# EAGLE schematic Schematic_v26 (EAGLE 9.7.0)
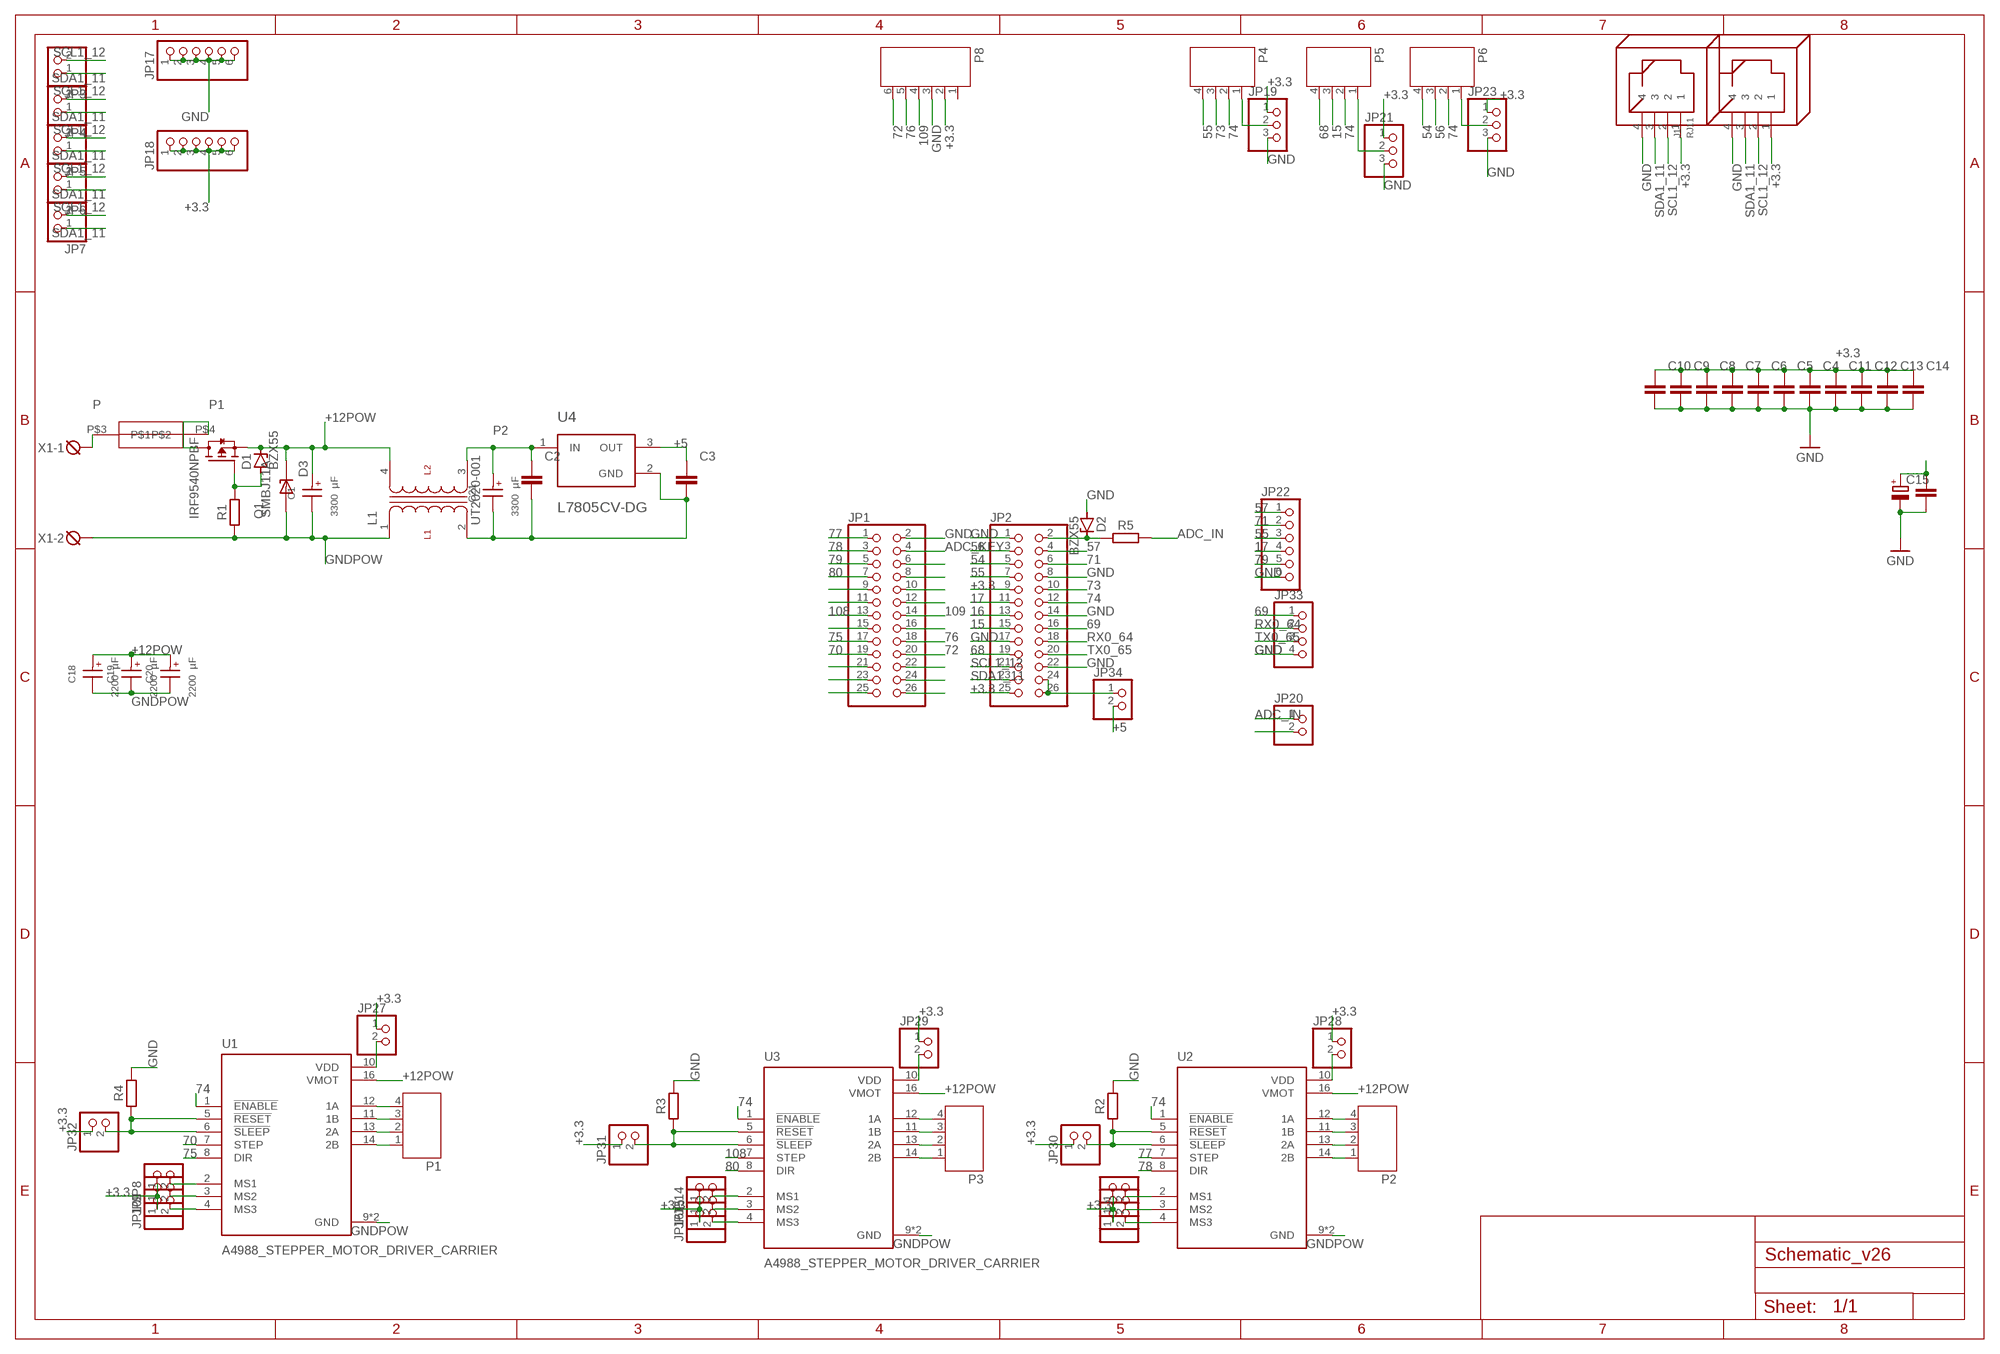
[diagram p0: schematic, sheet 1]

## Parts
C1  3300 µF  WCAP-AT1H_13X20_860240278009  [WCAP-AT1H_13X20(DXL)]
C2  C_CHIP-1206(3216-METRIC)  [CAPC3216X135]
C3  C_CHIP-0603(1608-METRIC)  [CAPC1608X85]
C4  C_CHIP-0603(1608-METRIC)  [CAPC1608X85]
C5  C_CHIP-0603(1608-METRIC)  [CAPC1608X85]
C6  C_CHIP-0603(1608-METRIC)  [CAPC1608X85]
C7  C_CHIP-0603(1608-METRIC)  [CAPC1608X85]
C8  C_CHIP-0603(1608-METRIC)  [CAPC1608X85]
C9  C_CHIP-0603(1608-METRIC)  [CAPC1608X85]
C10  C_CHIP-0603(1608-METRIC)  [CAPC1608X85]
C11  C_CHIP-1206(3216-METRIC)  [CAPC3216X135]
C12  C_CHIP-1206(3216-METRIC)  [CAPC3216X135]
C13  C_CHIP-1206(3216-METRIC)  [CAPC3216X135]
C14  C_CHIP-1206(3216-METRIC)  [CAPC3216X135]
C15  C-POL_RADIAL-11MM-DIA  [CAPPRD508W65D1000H1100B]
C18  2200 µF  WCAP-AT1H_13X20_860240278009  [WCAP-AT1H_13X20(DXL)]
C19  2200 µF  WCAP-AT1H_13X20_860240278009  [WCAP-AT1H_13X20(DXL)]
C20  2200 µF  WCAP-AT1H_13X20_860240278009  [WCAP-AT1H_13X20(DXL)]
C21  3300 µF  WCAP-AT1H_13X20_860240278009  [WCAP-AT1H_13X20(DXL)]
C22  C_CHIP-1206(3216-METRIC)  [CAPC3216X135]
D1  BZX55  [DO35Z10]
D2  BZX55  [DO35Z10]
D3  SMBJ11A  [DIOM4336X265N]
J1  RJ11  [RJ11]
J3  RJ11  [RJ11]
JP1  PINHD-2X13  [2X13]
JP2  PINHD-2X13  [2X13]
JP3  PINHD-1X2  [1X02]
JP4  PINHD-1X2  [1X02]
JP5  PINHD-1X2  [1X02]
JP6  PINHD-1X2  [1X02]
JP7  PINHD-1X2  [1X02]
JP8  PINHD-1X2  [1X02]
JP9  PINHD-1X2  [1X02]
JP10  PINHD-1X2  [1X02]
JP11  PINHD-1X2  [1X02]
JP12  PINHD-1X2  [1X02]
JP13  PINHD-1X2  [1X02]
JP14  PINHD-1X2  [1X02]
JP15  PINHD-1X2  [1X02]
JP16  PINHD-1X2  [1X02]
JP17  PINHD-1X6  [1X06]
JP18  PINHD-1X6  [1X06]
JP19  PINHD-1X3  [1X03]
JP20  PINHD-1X2  [1X02]
JP21  PINHD-1X3  [1X03]
JP22  PINHD-1X6  [1X06]
JP23  PINHD-1X3  [1X03]
JP27  PINHD-1X2  [1X02]
JP28  PINHD-1X2  [1X02]
JP29  PINHD-1X2  [1X02]
JP30  PINHD-1X2  [1X02]
JP31  PINHD-1X2  [1X02]
JP32  PINHD-1X2  [1X02]
JP33  PINHD-1X4  [1X04]
JP34  PINHD-1X2  [1X02]
L1  UT2020-001  [IND_UT2020-001]
P1  JST-PH4  [JST-PH4]
P2  JST-PH4  [JST-PH4]
P3  JST-PH4  [JST-PH4]
P4  JST-PH4  [JST-PH4]
P5  JST-PH4  [JST-PH4]
P6  JST-PH4  [JST-PH4]
P8  JST-PH6  [JST-PH6]
Q1  IRF9540NPBF  [TO254P1052X465X1989-3]
R1  R_AXIAL-7.2MM-PITCH  [RESAD724W46L381D178B]
R2  R_CHIP-1206(3216-METRIC)  [RESC3216X70]
R3  R_CHIP-1206(3216-METRIC)  [RESC3216X70]
R4  R_CHIP-1206(3216-METRIC)  [RESC3216X70]
R5  R_CHIP-1206(3216-METRIC)  [RESC3216X70]
U1  A4988_STEPPER_MOTOR_DRIVER_CARRIER  [MODULE_A4988_STEPPER_MOTOR_DRIVER_CARRIER]
U2  A4988_STEPPER_MOTOR_DRIVER_CARRIER  [MODULE_A4988_STEPPER_MOTOR_DRIVER_CARRIER]
U3  A4988_STEPPER_MOTOR_DRIVER_CARRIER  [MODULE_A4988_STEPPER_MOTOR_DRIVER_CARRIER]
U4  L7805CV-DG  [TO255P1040X460X2890-3]
U$1  POJ  [POJ]
X1  DG3XX-02-3.5  [DG350-3.5-02P]

## Nets
15: JP2.15 P5.3
16: JP2.13
17: JP2.11 JP22.4
54: JP2.5 P6.4
55: JP2.7 JP22.3 P4.4
56: JP2.3 P6.3
57: JP2.4 JP22.1
68: JP2.19 P5.4
69: JP2.16 JP33.1
70: JP1.19 U1.7(STEP)
71: JP2.6 JP22.2
72: JP1.20 P8.6
73: JP2.10 P4.3
74: JP2.12 P4.2 P5.2 P6.2 U1.1(!ENABLE) U2.1(!ENABLE) U3.1(!ENABLE)
75: JP1.17 U1.8(DIR)
76: JP1.18 P8.5
77: JP1.1 U2.7(STEP)
78: JP1.3 U2.8(DIR)
79: JP1.5 JP22.5
80: JP1.7 U3.8(DIR)
108: JP1.13 U3.7(STEP)
109: JP1.14 P8.4
+3.3 [lidlpower]: C4.1 C5.1 C6.1 C7.1 C8.1 C9.1 C10.1 C11.1 C12.1 C13.1 C14.1 J1.1 J3.1 JP2.9 JP2.25 JP8.1 JP9.1 JP10.1 JP11.1 JP12.1 JP13.1 JP14.1 JP15.1 JP16.1 JP18.1 JP18.2 JP18.3 JP18.4 JP18.5 JP18.6 JP19.1 JP21.1 JP23.1 JP27.1 JP28.1 JP29.1 JP30.1 JP31.1 JP32.1 P8.2
+5 [lidlpower]: C3.1 C15.1(+) C22.1 JP34.2 U4.3(OUT)
+12POW [power]: C1.1(+) C18.1(+) C19.1(+) C20.1(+) D1.C D3.C L1.4 Q1.3(S) U1.16(VMOT) U2.16(VMOT) U3.16(VMOT)
ADC_IN: JP20.1 R5.2
ADC_KEY: JP1.4
GND [lidlpower]: C2.2 C3.2 C4.2 C5.2 C6.2 C7.2 C8.2 C9.2 C10.2 C11.2 C12.2 C13.2 C14.2 C15.2(-) C21.2(-) C22.2 D2.A J1.4 J3.4 JP1.2 JP2.1 JP2.8 JP2.14 JP2.17 JP2.22 JP17.1 JP17.2 JP17.3 JP17.4 JP17.5 JP17.6 JP19.3 JP20.2 JP21.3 JP22.6 JP23.3 JP33.4 L1.2 P8.3 R2.2 R3.2 R4.2 U4.2(GND)
GNDPOW [power]: C1.2(-) C18.2(-) C19.2(-) C20.2(-) D3.A L1.1 R1.1 U1.9(GND) U1.15(GND) U2.9(GND) U2.15(GND) U3.9(GND) U3.15(GND) X1.2
N$1: JP8.2 U1.2(MS1)
N$2: P1.4 U1.12(1A)
N$3: P1.3 U1.11(1B)
N$4: P1.2 U1.13(2A)
N$5: JP1.9
N$6: JP1.11
N$7: P1.1 U1.14(2B)
N$8: JP1.15
N$9: P2.4 U2.12(1A)
N$10: P2.3 U2.11(1B)
N$11: JP1.21
N$12: JP1.23
N$13: JP1.25
N$14: P2.2 U2.13(2A)
N$15: P2.1 U2.14(2B)
N$16: JP1.6
N$17: JP1.8
N$18: JP1.10
N$19: JP1.12
N$20: P3.4 U3.12(1A)
N$21: JP1.16
N$22: P3.3 U3.11(1B)
N$23: P3.2 U3.13(2A)
N$24: JP1.22
N$25: JP1.24
N$26: JP1.26
N$27: P3.1 U3.14(2B)
N$28: JP9.2 U1.3(MS2)
N$29: JP10.2 U1.4(MS3)
N$30: JP11.2 U2.2(MS1)
N$31: JP12.2 U2.3(MS2)
N$32: JP13.2 U2.4(MS3)
N$33: JP14.2 U3.2(MS1)
N$34: JP15.2 U3.3(MS2)
N$35: JP16.2 U3.4(MS3)
N$36: JP2.24 JP2.26 JP34.1
N$37: JP30.2 R2.1 U2.5(!RESET) U2.6(!SLEEP)
N$38: JP31.2 R3.1 U3.5(!RESET) U3.6(!SLEEP)
N$40: D1.A Q1.1(G) R1.2
N$42: JP27.2 U1.10(VDD)
N$44: D2.C JP2.2 R5.1
N$46: JP29.2 U3.10(VDD)
N$47: JP19.2 P4.1
N$48: JP28.2 U2.10(VDD)
N$51: JP21.2 P5.1
N$55: JP23.2 P6.1
N$67: JP32.2 R4.1 U1.5(!RESET) U1.6(!SLEEP)
P [power]: U$1.P$3 X1.1
P1 [power]: Q1.2(D) U$1.P$4
P2 [lidlpower]: C2.1 C21.1(+) L1.3 U4.1(IN)
RX0_64: JP2.18 JP33.2
SCL1_12: J1.2 J3.2 JP2.21 JP3.2 JP4.2 JP5.2 JP6.2 JP7.2
SDA1_11: J1.3 J3.3 JP2.23 JP3.1 JP4.1 JP5.1 JP6.1 JP7.1
TX0_65: JP2.20 JP33.3
Unconnected: P8.1

## Library data of the parts
C1 C21 = Wurth_Capacitors_WCAP-AT1H:WCAP-AT1H_13X20: WCAP-AT1H Aluminium Electrolytic Capacitors Long Life +105 °C Characteristics Long life product series Mounting style: THT Radial Capacitance range: 6.8 µF ‒ 3300 µF Capacitance tolerance: ±20 % Voltage range (UR): 10 ‒ 450 V(DC) Operating temperature: -40 °C up to +105 °C for UR ≤100 V(DC) -25 °C up to +105 °C for UR > 100 V(DC) Endurance: 5000 ‒ 10000 h @ +105 °C Dimensions (DxL) in mm: 5.0 x 11.0 up to 18.0 x 35.5 Recommended soldering: Wave soldering Applications Long life applications (industry, medical) Filtering Smoothing Energy storage Coupling e.g. Switched-mode power supply, AC/DC converter, adapter, charger, digital camera <https://www.we-online.com/catalog/media/o14727v209%20Family_WCAP-AT1H.jpg> Details see: https://www.we-online.com/catalog/en/WCAP-AT1H/ Updated by yingchun,Shan;2020-02-28 2020(C) Würth Elektronik; DATASHEET-URL: https://www.we-online.com/catalog/datasheet/860240278009.pdf; DF: 19%; DIAMETER: 13mm; I-LEAK: 220uA; I-RIPPLE: 1540mA; L: 20mm; OPERATING-TEMPERATURE: -40 °C up to +105 °C; PART-NUMBER: 860240278009; PITCH: 5mm; TECHNICAL-REFERENCE: ATDI200222M010DSPACK000; VALUE: 2200 µF; VR: 10V(DC)
C2-C14 C22 = Capacitor:C: Capacitor - Generic; CATEGORY: Capacitor
C15 = Capacitor:C-POL: Capacitor Polarised - Generic; CATEGORY: Capacitor
C18-C20 = Wurth_Capacitors_WCAP-AT1H:WCAP-AT1H_13X20: WCAP-AT1H Aluminium Electrolytic Capacitors Long Life +105 °C Characteristics Long life product series Mounting style: THT Radial Capacitance range: 6.8 µF ‒ 3300 µF Capacitance tolerance: ±20 % Voltage range (UR): 10 ‒ 450 V(DC) Operating temperature: -40 °C up to +105 °C for UR ≤100 V(DC) -25 °C up to +105 °C for UR > 100 V(DC) Endurance: 5000 ‒ 10000 h @ +105 °C Dimensions (DxL) in mm: 5.0 x 11.0 up to 18.0 x 35.5 Recommended soldering: Wave soldering Applications Long life applications (industry, medical) Filtering Smoothing Energy storage Coupling e.g. Switched-mode power supply, AC/DC converter, adapter, charger, digital camera <https://www.we-online.com/catalog/media/o14727v209%20Family_WCAP-AT1H.jpg> Details see: https://www.we-online.com/catalog/en/WCAP-AT1H/ Updated by yingchun,Shan;2020-02-28 2020(C) Würth Elektronik; DATASHEET-URL: https://www.we-online.com/catalog/datasheet/860240278009.pdf; DF: 19%; DIAMETER: 13mm; I-LEAK: 220uA; I-RIPPLE: 1540mA; L: 20mm; OPERATING-TEMPERATURE: -40 °C up to +105 °C; PART-NUMBER: 860240278009; PITCH: 5mm; TECHNICAL-REFERENCE: ATDI200222M010DSPACK000; VR: 10V(DC)
D1 D2 = diode:BZX55: Z DIODE
D3 = SMBJ11A:SMBJ11A: Check availability <https://pricing.snapeda.com/parts/SMBJ11A/Taiwan%20Semiconductor/view-part?ref=eda>; AVAILABILITY: In Stock; CHECK_PRICES: https://www.snapeda.com/parts/SMBJ11A/taiwan/view-part/?ref=eda; DESCRIPTION: 600W, 12.9V, 5%, Unidirectional, TVS; MF: Taiwan Semiconductor; MP: SMBJ11A; PACKAGE: SMD-2 Taiwan Semiconductor; PRICE: None; SNAPEDA_LINK: https://www.snapeda.com/parts/SMBJ11A/taiwan/view-part/?ref=snap
J1 J3 = con-rj:RJ11: RJ11, RJ22 RJ11 and RJ22 jacks side mounted http://www.tycoelectronics.com
JP1 JP2 = pinhead:PINHD-2X13: PIN HEADER
JP3-JP16 JP20 JP27-JP32 JP34 = pinhead:PINHD-1X2: PIN HEADER
JP17 JP18 JP22 = pinhead:PINHD-1X6: PIN HEADER
JP19 JP21 JP23 = pinhead:PINHD-1X3: PIN HEADER
JP33 = pinhead:PINHD-1X4: PIN HEADER
L1 = UT2020-001:UT2020-001: Check availability <https://pricing.snapeda.com/parts/UT2020-001/Triad%20Magnetics/view-part?ref=eda>; AVAILABILITY: In Stock; CHECK_PRICES: https://www.snapeda.com/parts/UT2020-001/Triad+Magnetics/view-part/?ref=eda; DESCRIPTION: 9 mH @ 10 kHz 2 Line Common Mode Choke Through Hole 500mA DCR 1.4Ohm; MF: Triad Magnetics; MP: UT2020-001; PACKAGE: Horizontal-4 Triad Magnetics; PRICE: None; SNAPEDA_LINK: https://www.snapeda.com/parts/UT2020-001/Triad+Magnetics/view-part/?ref=snap
P1-P6 = jst-ph:JST-PH4
P8 = jst-ph:JST-PH6
Q1 = IRF9540NPBF:IRF9540NPBF: Check availability <https://pricing.snapeda.com/parts/IRF9540NPBF/Infineon%20Technologies/view-part?ref=eda>; AVAILABILITY: In Stock; CHECK_PRICES: https://www.snapeda.com/parts/IRF9540NPBF/Infineon/view-part/?ref=eda; DESCRIPTION: Power MOSFET,P-Ch,VDSS -100V,RDS(ON) 0.117Ohm,ID -23A,TO-220AB,PD 140W,VGS+/-20V | Infineon IRF9540NPBF; MF: Infineon Technologies; MP: IRF9540NPBF; PACKAGE: TO-220 Infineon; PRICE: None; SNAPEDA_LINK: https://www.snapeda.com/parts/IRF9540NPBF/Infineon/view-part/?ref=snap
R1-R5 = Resistor:R: Resistor Fixed - Generic; CATEGORY: Resistor; SUB-CATEGORY: Fixed
U1-U3 = A4988_STEPPER_MOTOR_DRIVER_CARRIER:A4988_STEPPER_MOTOR_DRIVER_CARRIER: Check availability <https://pricing.snapeda.com/parts/A4988%20STEPPER%20MOTOR%20DRIVER%20CARRIER/Pololu/view-part?ref=eda>; AVAILABILITY: Not in stock; CHECK_PRICES: https://www.snapeda.com/parts/A4988%20STEPPER%20MOTOR%20DRIVER%20CARRIER/Pololu/view-part/?ref=eda; DESCRIPTION: Stepper Motor Driver; MF: Pololu; MP: A4988 STEPPER MOTOR DRIVER CARRIER; PACKAGE: None; PRICE: None; SNAPEDA_LINK: https://www.snapeda.com/parts/A4988%20STEPPER%20MOTOR%20DRIVER%20CARRIER/Pololu/view-part/?ref=snap
U4 = L7805CV-DG:L7805CV-DG: Check availability <https://pricing.snapeda.com/parts/L7805CV-DG/STMicroelectronics/view-part?ref=eda>; AVAILABILITY: In Stock; CHECK_PRICES: https://www.snapeda.com/parts/L7805CV-DG/STMicroelectronics/view-part/?ref=eda; DESCRIPTION: Linear Voltage Regulator IC Positive Fixed 1 Output 1.5A TO-220; MF: STMicroelectronics; MP: L7805CV-DG; PACKAGE: TO-220 STMicroelectronics; PRICE: None; SNAPEDA_LINK: https://www.snapeda.com/parts/L7805CV-DG/STMicroelectronics/view-part/?ref=snap
U$1 = Library:POJ
X1 = degson:DG3XX-02: DG350-3.5-02P DG306-5.0-02P

## Net classes
0 default: width 0.318 mm
1 power: width 2 mm
2 lidlpower: width 1 mm